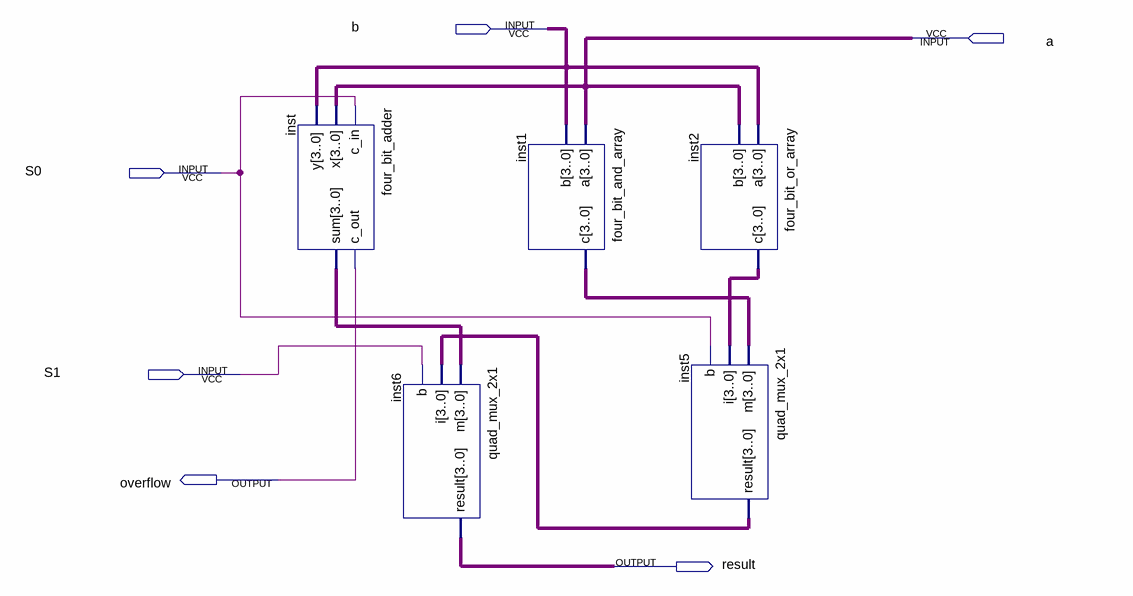
[diagram p0: schematic sheet]
// Quartus schematic BD.bdf as structural Verilog: 5 symbols, 6 pins
module BD (
  input  b,
  input  a,
  input  S0,
  input  S1,
  output overflow,
  output result
);

  wire [3:0] inst1_c, inst2_c, inst5_result, inst6_result, inst_sum, undriven, undriven_2;

  four_bit_adder inst (.c_in(S0), .x(undriven), .y(undriven_2), .c_out(overflow), .sum(inst_sum));
  quad_mux_2x1 inst6 (.m(inst_sum), .i(inst5_result), .b(S1), .result(inst6_result));
  four_bit_and_array inst1 (.a(undriven), .b(undriven_2), .c(inst1_c));
  four_bit_or_array inst2 (.a(undriven_2), .b(undriven), .c(inst2_c));
  quad_mux_2x1 inst5 (.m(inst1_c), .i(inst2_c), .b(S0), .result(inst5_result));
endmodule
